# EAGLE design RasPi-BplusHAT (EAGLE 7.3.0)
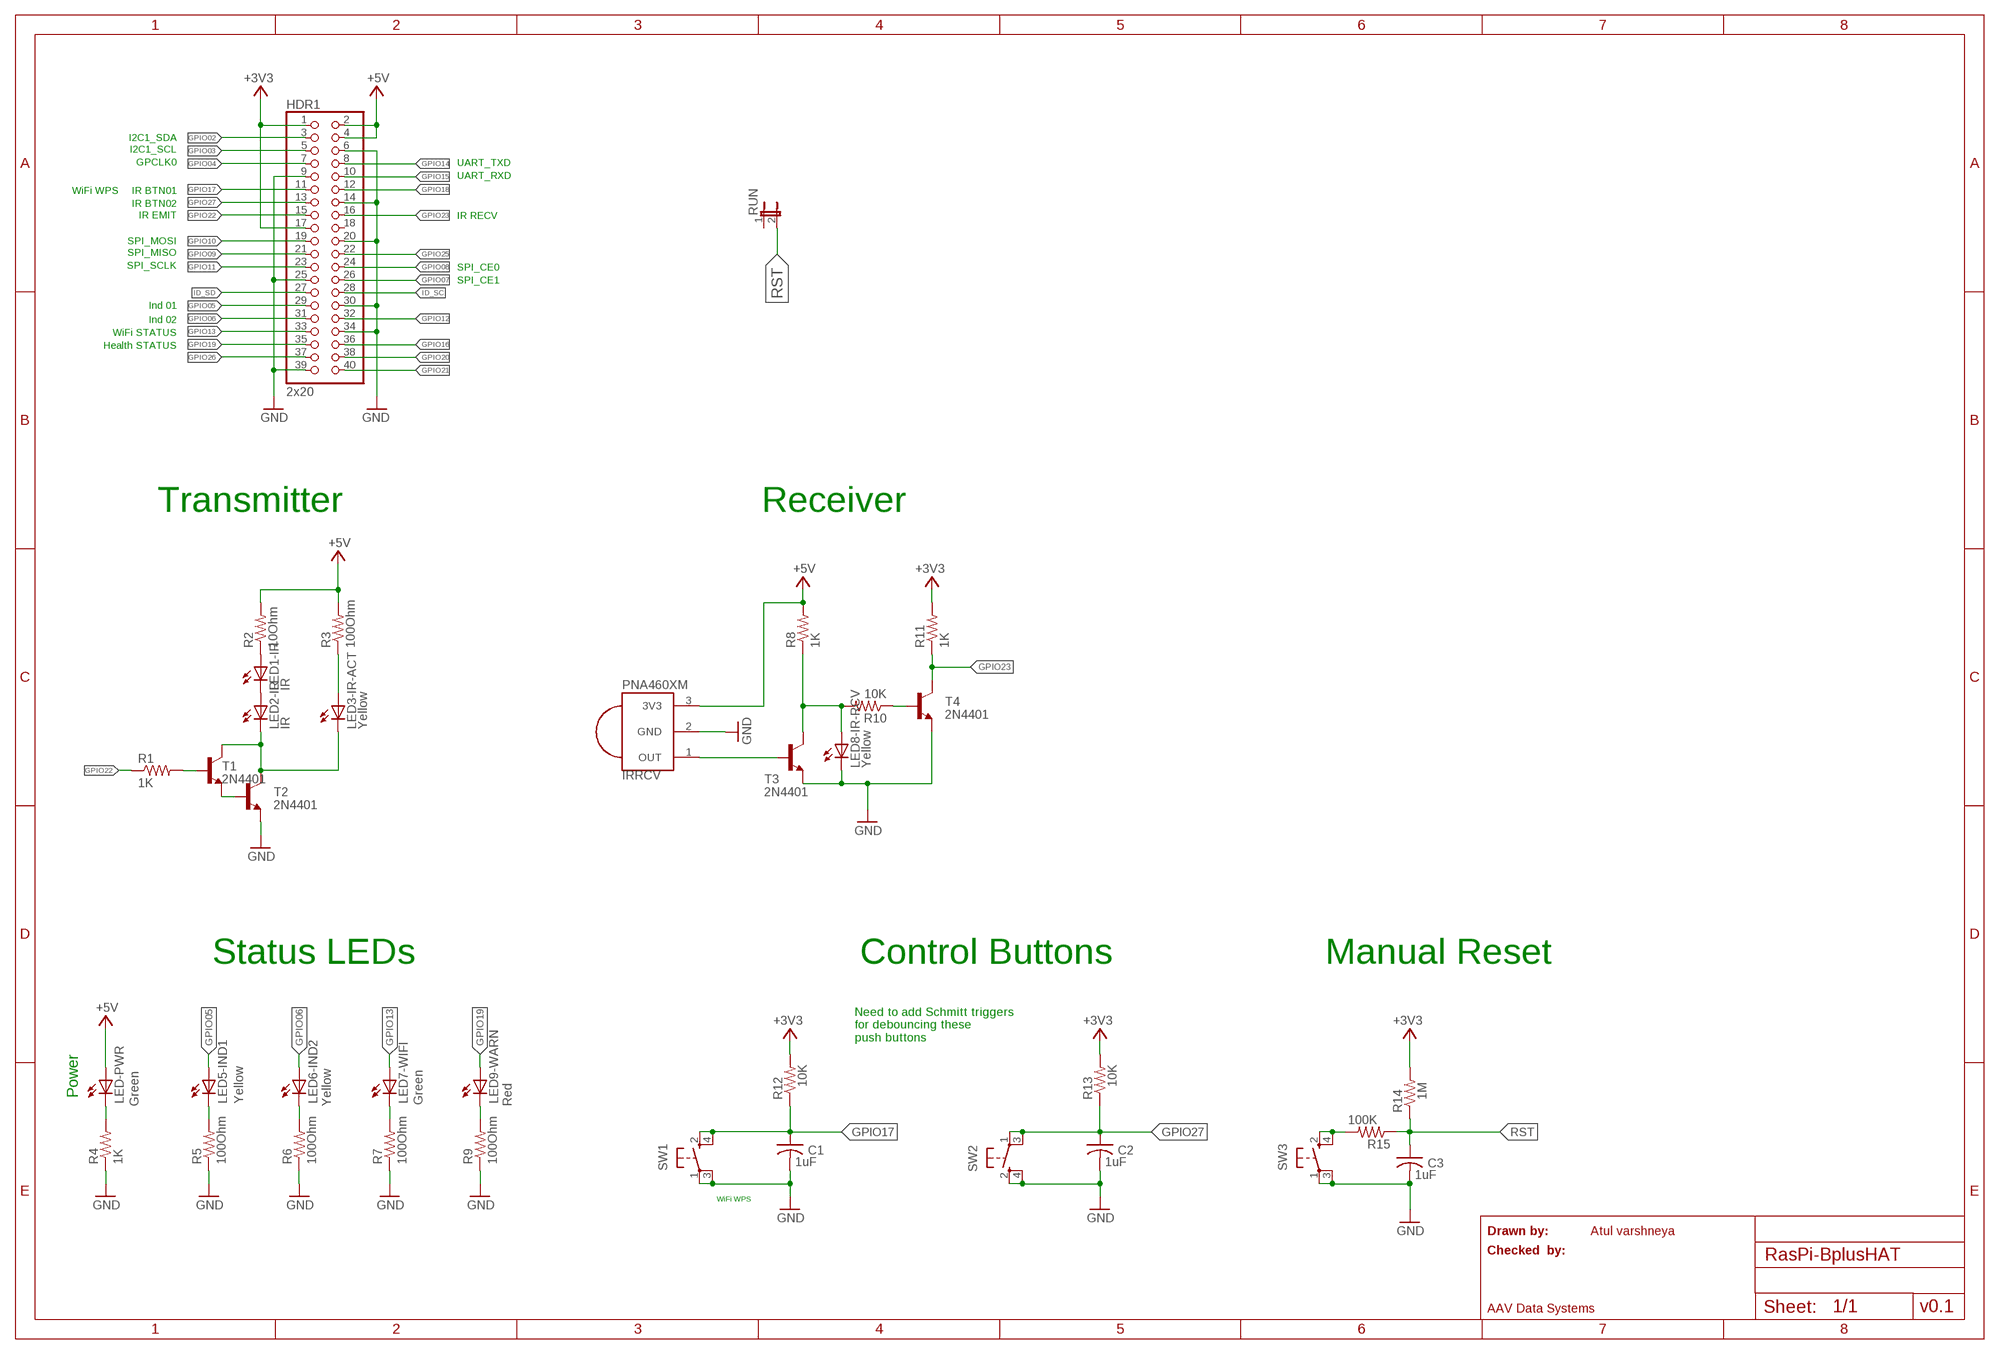
[diagram p0: schematic, sheet 1]

## Parts
C1  1uF  C-USC0805  [C0805]
C2  1uF  C-USC0805  [C0805]
C3  1uF  C-USC0805  [C0805]
HDR1  2x20  PINHD-2X20  [2X20]
IRRCV  PNA460XM  [PNA460XM]
LED1-IR  IR  LEDMICRO-SIDELED  [MICRO-SIDELED]
LED2-IR  IR  LEDMICRO-SIDELED  [MICRO-SIDELED]
LED3-IR-ACT  Yellow  LEDCHIPLED_0805  [CHIPLED_0805]
LED5-IND1  Yellow  LEDCHIPLED_0805  [CHIPLED_0805]
LED6-IND2  Yellow  LEDCHIPLED_0805  [CHIPLED_0805]
LED7-WIFI  Green  LEDCHIPLED_0805  [CHIPLED_0805]
LED8-IR-RCV  Yellow  LEDCHIPLED_0805  [CHIPLED_0805]
LED9-WARN  Red  LEDCHIPLED_0805  [CHIPLED_0805]
LED-PWR  Green  LEDCHIPLED_0805  [CHIPLED_0805]
R1  1K  R-US_R0805  [R0805]
R2  10Ohm  R-US_R0805  [R0805]
R3  100Ohm  R-US_R0805  [R0805]
R4  1K  R-US_R0805  [R0805]
R5  100Ohm  R-US_R0805  [R0805]
R6  100Ohm  R-US_R0805  [R0805]
R7  100Ohm  R-US_R0805  [R0805]
R8  1K  R-US_R0805  [R0805]
R9  100Ohm  R-US_R0805  [R0805]
R10  10K  R-US_R0805  [R0805]
R11  1K  R-US_R0805  [R0805]
R12  10K  R-US_R0805  [R0805]
R13  10K  R-US_R0805  [R0805]
R14  1M  R-US_R0805  [R0805]
R15  100K  R-US_R0805  [R0805]
RUN  JP1E  [JP1]
SW1  SPST_TACT-KMR2  [KMR2]
SW2  SPST_TACT-KMR2  [KMR2]
SW3  SPST_TACT-KMR2  [KMR2]
T1  2N4401  MMBT4401LT1-NPN-SOT23-BEC  [SOT23-BEC]
T2  2N4401  MMBT4401LT1-NPN-SOT23-BEC  [SOT23-BEC]
T3  2N4401  MMBT4401LT1-NPN-SOT23-BEC  [SOT23-BEC]
T4  2N4401  MMBT4401LT1-NPN-SOT23-BEC  [SOT23-BEC]

## Nets
+3V3: HDR1.1 HDR1.17 R11.2 R12.2 R13.2 R14.2
+5V: HDR1.2 HDR1.4 IRRCV.3(3V3) LED-PWR.A R2.2 R3.2 R8.2
GND: C1.2 C2.2 C3.2 HDR1.6 HDR1.9 HDR1.14 HDR1.20 HDR1.25 HDR1.30 HDR1.34 HDR1.39 IRRCV.2(GND) LED8-IR-RCV.C R4.1 R5.1 R6.1 R7.1 R9.1 SW1.1(P) SW1.3(P1) SW2.2(S) SW2.4(S1) SW3.1(P) SW3.3(P1) T2.E T3.E T4.E
GPIO02: HDR1.3
GPIO03: HDR1.5
GPIO04: HDR1.7
GPIO05: HDR1.29 LED5-IND1.A
GPIO06: HDR1.31 LED6-IND2.A
GPIO07: HDR1.26
GPIO08: HDR1.24
GPIO09: HDR1.21
GPIO10: HDR1.19
GPIO11: HDR1.23
GPIO12: HDR1.32
GPIO13: HDR1.33 LED7-WIFI.A
GPIO14: HDR1.8
GPIO15: HDR1.10
GPIO16: HDR1.36
GPIO17: C1.1 HDR1.11 R12.1 SW1.2(S) SW1.4(S1)
GPIO18: HDR1.12
GPIO19: HDR1.35 LED9-WARN.A
GPIO20: HDR1.38
GPIO21: HDR1.40
GPIO22: HDR1.15 R1.1
GPIO23: HDR1.16 R11.1 T4.C
GPIO25: HDR1.22
GPIO26: HDR1.37
GPIO27: C2.1 HDR1.13 R13.1 SW2.1(P) SW2.3(P1)
ID_SC: HDR1.28
ID_SD: HDR1.27
N$1: R15.2 SW3.2(S) SW3.4(S1)
N$2: LED1-IR.A R2.1
N$3: LED1-IR.C LED2-IR.A
N$4: LED2-IR.C LED3-IR-ACT.C T1.C T2.C
N$5: R1.2 T1.B
N$6: LED3-IR-ACT.A R3.1
N$7: LED5-IND1.C R5.2
N$8: IRRCV.1(OUT) T3.B
N$10: LED8-IR-RCV.A R8.1 R10.2 T3.C
N$11: T1.E T2.B
N$14: LED7-WIFI.C R7.2
N$16: LED9-WARN.C R9.2
N$17: LED6-IND2.C R6.2
N$21: LED-PWR.C R4.2
N$23: R10.1 T4.B
RST: C3.1 R14.1 R15.1 RUN.2
Unconnected: HDR1.18 RUN.1

## Notes on the sheet
- I2C1_SDA
- I2C1_SCL
- GPCLK0
- UART_TXD
- UART_RXD
- WiFi WPS | IR BTN01
- IR BTN02
- IR EMIT
- IR RECV
- SPI_MOSI
- SPI_MISO
- SPI_SCLK
- SPI_CE0
- SPI_CE1
- Ind 01
- Ind 02
- WiFi STATUS
- Health STATUS
- Receiver
- Transmitter
- Status LEDs | Control Buttons | Manual Reset
- Need to add Schmitt triggers 
  for debouncing these 
  push buttons
- Power
- WiFi WPS
- Drawn by: | Atul varshneya
- Checked  by:
- AAV Data Systems | v0.1

## Library data of the parts
C1-C3 = adafruit:C-US: CAPACITOR, American symbol; MPN: MC0805B104K160CT; OC_NEWARK: 06R3738
HDR1 = adafruit:PINHD-2X20: PIN HEADER; OC_NEWARK: unknown
IRRCV = adafruit:PNA460XM: IR 38KHz receiver PNA4602 and related receivers http://www.ladyada.net/library/pcb/eaglelibrary.html; MPN: TSOP38238; OC_NEWARK: 02P9885
LED1-IR LED2-IR = led:LED: LED OSRAM: - CHIPLED LG R971, LG N971, LY N971, LG Q971, LY Q971, LO R971, LY R971 LH N974, LH R974 LS Q976, LO Q976, LY Q976 LO Q996 - Hyper CHIPLED LW Q18S LB Q993, LB Q99A, LB R99A - SideLED LS A670, LO A670, LY A670, LG A670, LP A670 LB A673, LV A673, LT A673, LW A673 LH A674 LY A675 LS A676, LA A676, LO A676, LY A676, LW A676 LS A679, LY A679, LG A679 - Hyper Micro SIDELED® LS Y876, LA Y876, LO Y876, LY Y876 LT Y87S - SmartLED LW L88C, LW L88S LB L89C, LB L89S, LG L890 LS L89K, LO L89K, LY L89K LS L896, LA L896, LO L896, LY L896 - TOPLED LS T670, LO T670, LY T670, LG T670, LP T670 LSG T670, LSP T670, LSY T670, LOP T670, LYG T670 LG T671, LOG T671, LSG T671 LB T673, LV T673, LT T673, LW T673 LH T674 LS T676, LA T676, LO T676, LY T676, LB T676, LH T676, LSB T676, LW T676 LB T67C, LV T67C, LT T67C, LS T67K, LO T67K, LY T67K, LW E67C LS E67B, LA E67B, LO E67B, LY E67B, LB E67C, LV E67C, LT E67C LW T67C LS T679, LY T679, LG T679 LS T770, LO T770, LY T770, LG T770, LP T770 LB T773, LV T773, LT T773, LW T773 LH T774 LS E675, LA E675, LY E675, LS T675 LS T776, LA T776, LO T776, LY T776, LB T776 LHGB T686 LT T68C, LB T68C - Hyper Mini TOPLED® LB M676 - Mini TOPLED Santana® LG M470 LS M47K, LO M47K, LY M47K Source: http://www.osram.convergy.de LUXEON: - LUMILED® LXK2-PW12-R00, LXK2-PW12-S00, LXK2-PW14-U00, LXK2-PW14-V00 LXK2-PM12-R00, LXK2-PM12-S00, LXK2-PM14-U00 LXK2-PE12-Q00, LXK2-PE12-R00, LXK2-PE12-S00, LXK2-PE14-T00, LXK2-PE14-U00 LXK2-PB12-K00, LXK2-PB12-L00, LXK2-PB12-M00, LXK2-PB14-N00, LXK2-PB14-P00, LXK2-PB14-Q00 LXK2-PR12-L00, LXK2-PR12-M00, LXK2-PR14-Q00, LXK2-PR14-R00 LXK2-PD12-Q00, LXK2-PD12-R00, LXK2-PD12-S00 LXK2-PH12-R00, LXK2-PH12-S00 LXK2-PL12-P00, LXK2-PL12-Q00, LXK2-PL12-R00 Source: www.luxeon.com KINGBRIGHT: KA-3528ASYC Source: www.kingbright.com; MPN: VSMB2943SLX01; OC_NEWARK: 62W1340
LED3-IR-ACT LED5-IND1 LED6-IND2 LED8-IR-RCV = led:LED: LED OSRAM: - CHIPLED LG R971, LG N971, LY N971, LG Q971, LY Q971, LO R971, LY R971 LH N974, LH R974 LS Q976, LO Q976, LY Q976 LO Q996 - Hyper CHIPLED LW Q18S LB Q993, LB Q99A, LB R99A - SideLED LS A670, LO A670, LY A670, LG A670, LP A670 LB A673, LV A673, LT A673, LW A673 LH A674 LY A675 LS A676, LA A676, LO A676, LY A676, LW A676 LS A679, LY A679, LG A679 - Hyper Micro SIDELED® LS Y876, LA Y876, LO Y876, LY Y876 LT Y87S - SmartLED LW L88C, LW L88S LB L89C, LB L89S, LG L890 LS L89K, LO L89K, LY L89K LS L896, LA L896, LO L896, LY L896 - TOPLED LS T670, LO T670, LY T670, LG T670, LP T670 LSG T670, LSP T670, LSY T670, LOP T670, LYG T670 LG T671, LOG T671, LSG T671 LB T673, LV T673, LT T673, LW T673 LH T674 LS T676, LA T676, LO T676, LY T676, LB T676, LH T676, LSB T676, LW T676 LB T67C, LV T67C, LT T67C, LS T67K, LO T67K, LY T67K, LW E67C LS E67B, LA E67B, LO E67B, LY E67B, LB E67C, LV E67C, LT E67C LW T67C LS T679, LY T679, LG T679 LS T770, LO T770, LY T770, LG T770, LP T770 LB T773, LV T773, LT T773, LW T773 LH T774 LS E675, LA E675, LY E675, LS T675 LS T776, LA T776, LO T776, LY T776, LB T776 LHGB T686 LT T68C, LB T68C - Hyper Mini TOPLED® LB M676 - Mini TOPLED Santana® LG M470 LS M47K, LO M47K, LY M47K Source: http://www.osram.convergy.de LUXEON: - LUMILED® LXK2-PW12-R00, LXK2-PW12-S00, LXK2-PW14-U00, LXK2-PW14-V00 LXK2-PM12-R00, LXK2-PM12-S00, LXK2-PM14-U00 LXK2-PE12-Q00, LXK2-PE12-R00, LXK2-PE12-S00, LXK2-PE14-T00, LXK2-PE14-U00 LXK2-PB12-K00, LXK2-PB12-L00, LXK2-PB12-M00, LXK2-PB14-N00, LXK2-PB14-P00, LXK2-PB14-Q00 LXK2-PR12-L00, LXK2-PR12-M00, LXK2-PR14-Q00, LXK2-PR14-R00 LXK2-PD12-Q00, LXK2-PD12-R00, LXK2-PD12-S00 LXK2-PH12-R00, LXK2-PH12-S00 LXK2-PL12-P00, LXK2-PL12-Q00, LXK2-PL12-R00 Source: www.luxeon.com KINGBRIGHT: KA-3528ASYC Source: www.kingbright.com; MPN: 150080YS75000; OC_NEWARK: 95W3804
LED7-WIFI LED-PWR = led:LED: LED OSRAM: - CHIPLED LG R971, LG N971, LY N971, LG Q971, LY Q971, LO R971, LY R971 LH N974, LH R974 LS Q976, LO Q976, LY Q976 LO Q996 - Hyper CHIPLED LW Q18S LB Q993, LB Q99A, LB R99A - SideLED LS A670, LO A670, LY A670, LG A670, LP A670 LB A673, LV A673, LT A673, LW A673 LH A674 LY A675 LS A676, LA A676, LO A676, LY A676, LW A676 LS A679, LY A679, LG A679 - Hyper Micro SIDELED® LS Y876, LA Y876, LO Y876, LY Y876 LT Y87S - SmartLED LW L88C, LW L88S LB L89C, LB L89S, LG L890 LS L89K, LO L89K, LY L89K LS L896, LA L896, LO L896, LY L896 - TOPLED LS T670, LO T670, LY T670, LG T670, LP T670 LSG T670, LSP T670, LSY T670, LOP T670, LYG T670 LG T671, LOG T671, LSG T671 LB T673, LV T673, LT T673, LW T673 LH T674 LS T676, LA T676, LO T676, LY T676, LB T676, LH T676, LSB T676, LW T676 LB T67C, LV T67C, LT T67C, LS T67K, LO T67K, LY T67K, LW E67C LS E67B, LA E67B, LO E67B, LY E67B, LB E67C, LV E67C, LT E67C LW T67C LS T679, LY T679, LG T679 LS T770, LO T770, LY T770, LG T770, LP T770 LB T773, LV T773, LT T773, LW T773 LH T774 LS E675, LA E675, LY E675, LS T675 LS T776, LA T776, LO T776, LY T776, LB T776 LHGB T686 LT T68C, LB T68C - Hyper Mini TOPLED® LB M676 - Mini TOPLED Santana® LG M470 LS M47K, LO M47K, LY M47K Source: http://www.osram.convergy.de LUXEON: - LUMILED® LXK2-PW12-R00, LXK2-PW12-S00, LXK2-PW14-U00, LXK2-PW14-V00 LXK2-PM12-R00, LXK2-PM12-S00, LXK2-PM14-U00 LXK2-PE12-Q00, LXK2-PE12-R00, LXK2-PE12-S00, LXK2-PE14-T00, LXK2-PE14-U00 LXK2-PB12-K00, LXK2-PB12-L00, LXK2-PB12-M00, LXK2-PB14-N00, LXK2-PB14-P00, LXK2-PB14-Q00 LXK2-PR12-L00, LXK2-PR12-M00, LXK2-PR14-Q00, LXK2-PR14-R00 LXK2-PD12-Q00, LXK2-PD12-R00, LXK2-PD12-S00 LXK2-PH12-R00, LXK2-PH12-S00 LXK2-PL12-P00, LXK2-PL12-Q00, LXK2-PL12-R00 Source: www.luxeon.com KINGBRIGHT: KA-3528ASYC Source: www.kingbright.com; MPN: 150080GS75000; OC_NEWARK: 95W3800
LED9-WARN = led:LED: LED OSRAM: - CHIPLED LG R971, LG N971, LY N971, LG Q971, LY Q971, LO R971, LY R971 LH N974, LH R974 LS Q976, LO Q976, LY Q976 LO Q996 - Hyper CHIPLED LW Q18S LB Q993, LB Q99A, LB R99A - SideLED LS A670, LO A670, LY A670, LG A670, LP A670 LB A673, LV A673, LT A673, LW A673 LH A674 LY A675 LS A676, LA A676, LO A676, LY A676, LW A676 LS A679, LY A679, LG A679 - Hyper Micro SIDELED® LS Y876, LA Y876, LO Y876, LY Y876 LT Y87S - SmartLED LW L88C, LW L88S LB L89C, LB L89S, LG L890 LS L89K, LO L89K, LY L89K LS L896, LA L896, LO L896, LY L896 - TOPLED LS T670, LO T670, LY T670, LG T670, LP T670 LSG T670, LSP T670, LSY T670, LOP T670, LYG T670 LG T671, LOG T671, LSG T671 LB T673, LV T673, LT T673, LW T673 LH T674 LS T676, LA T676, LO T676, LY T676, LB T676, LH T676, LSB T676, LW T676 LB T67C, LV T67C, LT T67C, LS T67K, LO T67K, LY T67K, LW E67C LS E67B, LA E67B, LO E67B, LY E67B, LB E67C, LV E67C, LT E67C LW T67C LS T679, LY T679, LG T679 LS T770, LO T770, LY T770, LG T770, LP T770 LB T773, LV T773, LT T773, LW T773 LH T774 LS E675, LA E675, LY E675, LS T675 LS T776, LA T776, LO T776, LY T776, LB T776 LHGB T686 LT T68C, LB T68C - Hyper Mini TOPLED® LB M676 - Mini TOPLED Santana® LG M470 LS M47K, LO M47K, LY M47K Source: http://www.osram.convergy.de LUXEON: - LUMILED® LXK2-PW12-R00, LXK2-PW12-S00, LXK2-PW14-U00, LXK2-PW14-V00 LXK2-PM12-R00, LXK2-PM12-S00, LXK2-PM14-U00 LXK2-PE12-Q00, LXK2-PE12-R00, LXK2-PE12-S00, LXK2-PE14-T00, LXK2-PE14-U00 LXK2-PB12-K00, LXK2-PB12-L00, LXK2-PB12-M00, LXK2-PB14-N00, LXK2-PB14-P00, LXK2-PB14-Q00 LXK2-PR12-L00, LXK2-PR12-M00, LXK2-PR14-Q00, LXK2-PR14-R00 LXK2-PD12-Q00, LXK2-PD12-R00, LXK2-PD12-S00 LXK2-PH12-R00, LXK2-PH12-S00 LXK2-PL12-P00, LXK2-PL12-Q00, LXK2-PL12-R00 Source: www.luxeon.com KINGBRIGHT: KA-3528ASYC Source: www.kingbright.com; MPN: 150080RS75000; OC_NEWARK: 95W3801
R1 R4 R8 R11 = adafruit:R-US_: RESISTOR, American symbol; MF: VISHAY/DALE; MPN: CRCW08051K00FKEA; OC_NEWARK: 52K9723
R2 = adafruit:R-US_: RESISTOR, American symbol; MF: VISHAY/DALE; MPN: CRCW080510R0FKEA; OC_NEWARK: 52K9804
R3 R5-R7 R9 = adafruit:R-US_: RESISTOR, American symbol; MF: VISHAY/DALE; MPN: CRCW0805100RFKEA; OC_NEWARK: 52K9809
R10 R12-R15 = adafruit:R-US_: RESISTOR, American symbol; MF: VISHAY/DALE; MPN: CRCW080510K0FKEA; OC_NEWARK: 52K9795
RUN = jumper:JP1E: JUMPER; MPN: 2211S-02G; OC_NEWARK: 08N6744
SW1-SW3 = adafruit:SPST_TACT: SMT 6mm switch, EVQQ2 series http://www.ladyada.net/library/eagle; OC_NEWARK: unknown
T1 T2 = transistor-neu-to92:*-NPN-: NPN Transistror BF959 corrected 2008.03.06; MPN: MMBT4401-TP; OC_NEWARK: 51T4931
T3 T4 = transistor:*-NPN-: NPN Transistror BF959 corrected 2008.03.06; MPN: MMBT4401-TP; OC_NEWARK: 51T4931

## Board
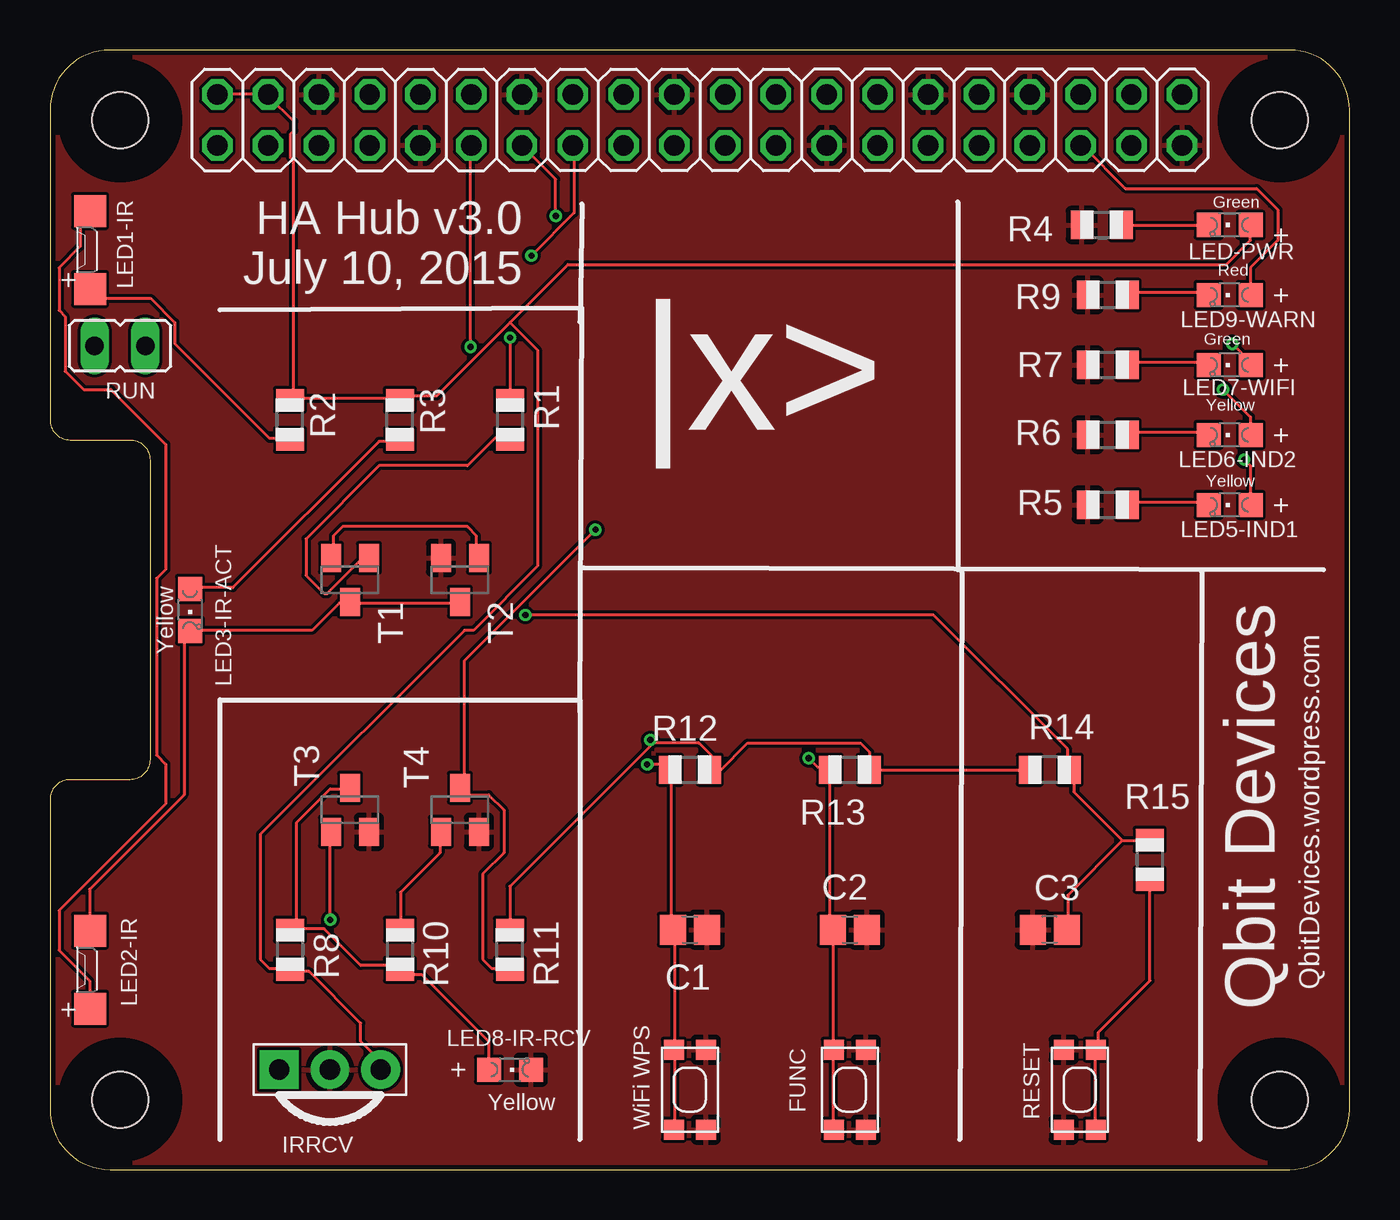
[diagram p1: board, top side]
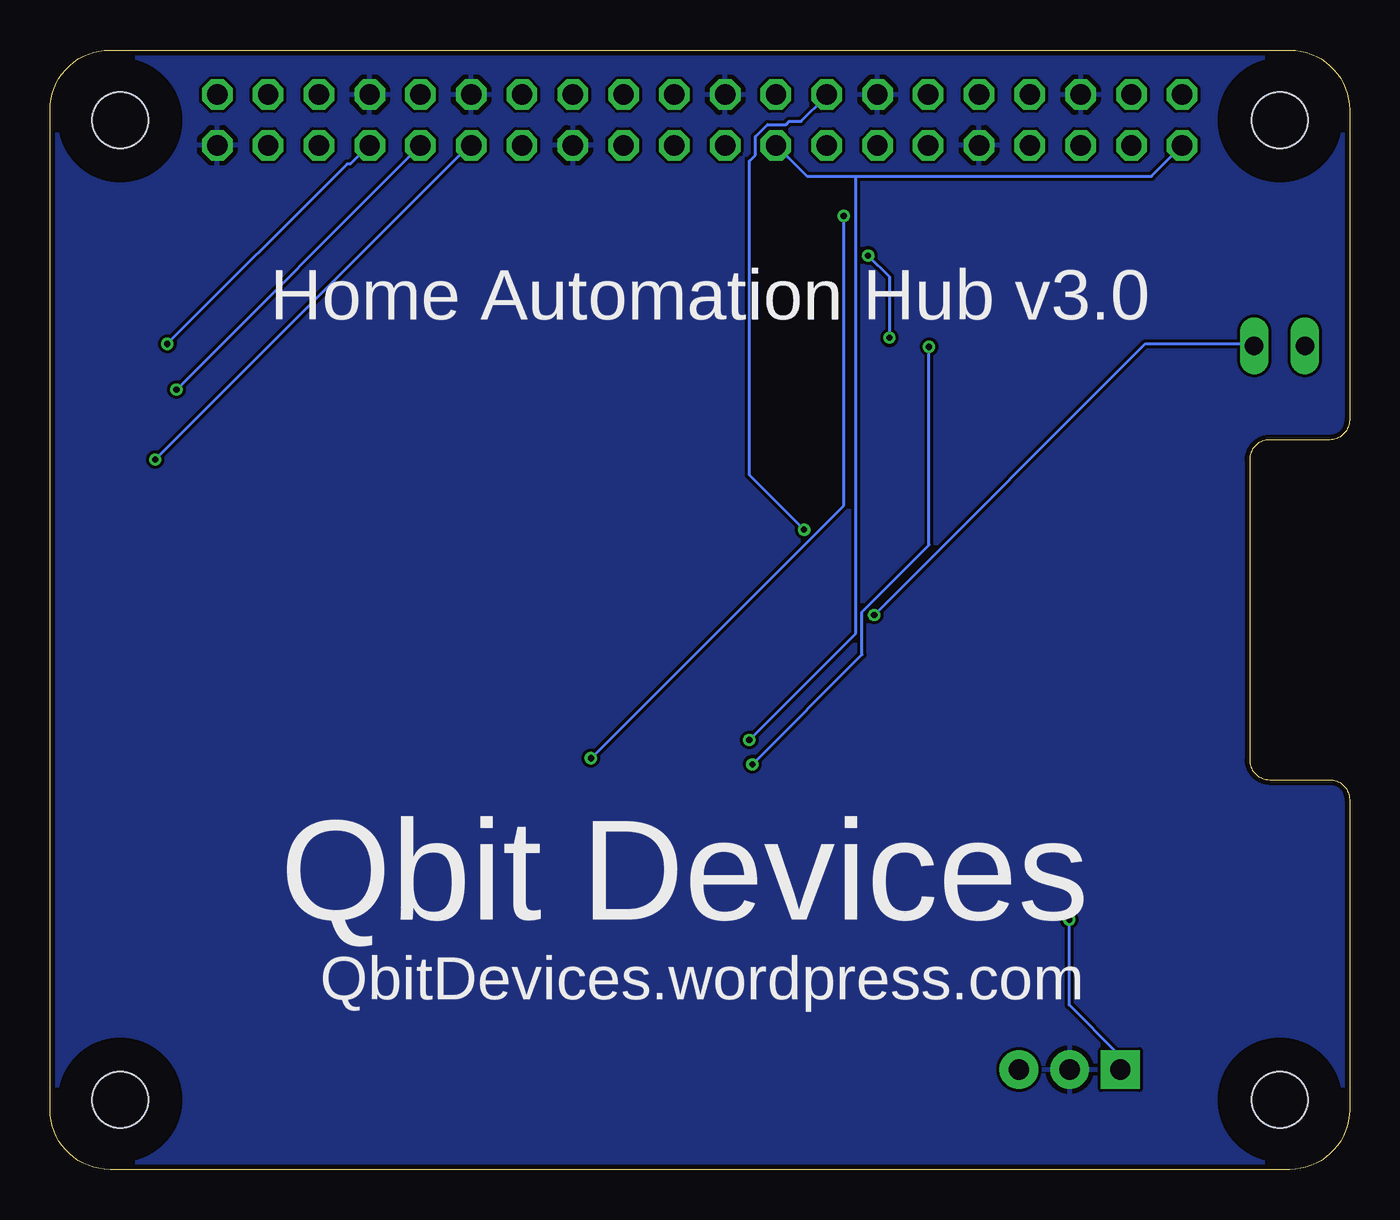
[diagram p2: board, bottom side, seen from below]

Size 65 x 56 mm. Coordinates in mm from the lower left corner, seen from the top.
Outline: 0,3 arc90 3,0 62,0 arc90 65,3 65,53 arc90 62,56 3,56 arc90 0,53 0,37.5 arc90 1,36.5 4,36.5 arc-90 5,35.5 5,20.5 arc-90 4,19.5 1,19.5 arc90 0,18.5 0,3
Copper layers (1*16): Top 0.035mm / dielectric 1.5mm / Bottom 0.035mm
Design rules "ITEADstudio_DRC": minimum track width 6mil, minimum drill 12mil, track to track 6mil, track to pad 6mil, pad to pad 6mil, via to via 6mil, smd to smd 0mil, copper to edge 10mil, drill to drill 10mil, minimum pad ring 10mil, minimum via ring 6mil, stop-mask expansion 2mil, vias tented up to drill 100mil, thermal gap 10mil
Holes 2.8 mm at 3.5,3.5 3.5,52.5 61.5,52.5 61.5,3.5
tRestrict: area 1.9,51 to 5,54; area 60,51 to 63,54; area 60,1.9 to 63,5; area 1.9,1.9 to 5,5
bRestrict: area 1.9,1.9 to 5,5; area 1.9,51 to 5,54; area 60,1.9 to 63,5; area 60,51 to 63,54

### Footprints (pad centres in the part's own frame; a part is rotated, then mirrored left to right if it is on the bottom)
C0805 = smd 1.3 x 1.5: 1 -0.85,0; 2 0.85,0
2X20 = drill 1.016 octagon: 1 -24.13,-1.27; 2 -24.13,1.27; 3 -21.59,-1.27; 4 -21.59,1.27; 5 -19.05,-1.27; 6 -19.05,1.27; 7 -16.51,-1.27; 8 -16.51,1.27; 9 -13.97,-1.27; 10 -13.97,1.27; 11 -11.43,-1.27; 12 -11.43,1.27; 13 -8.89,-1.27; 14 -8.89,1.27; 15 -6.35,-1.27; 16 -6.35,1.27; 17 -3.81,-1.27; 18 -3.81,1.27; 19 -1.27,-1.27; 20 -1.27,1.27; 21 1.27,-1.27; 22 1.27,1.27; 23 3.81,-1.27; 24 3.81,1.27; 25 6.35,-1.27; 26 6.35,1.27; 27 8.89,-1.27; 28 8.89,1.27; 29 11.43,-1.27; 30 11.43,1.27; 31 13.97,-1.27; 32 13.97,1.27; 33 16.51,-1.27; 34 16.51,1.27; 35 19.05,-1.27; 36 19.05,1.27; 37 21.59,-1.27; 38 21.59,1.27; 39 24.13,-1.27; 40 24.13,1.27
PNA460XM = drill 1.016 pad 1.93 square: 1 -2.54,0 | drill 1.016 pad 1.93: 2 0,0; 3 2.54,0
MICRO-SIDELED = smd 1.6 x 1.6: A 0,1.95; C 0,-1.95
CHIPLED_0805 = smd 1.2 x 1.2: A 0,-1.05; C 0,1.05
R0805 = smd 1.1 x 1.4: 1 -1,0; 2 1,0
JP1 = drill 0.914 long: 1 0,-1.27; 2 0,1.27
KMR2 = smd 1 x 1: 1 2,0.8; 2 2,-0.8; 3 -2,0.8; 4 -2,-0.8
SOT23-BEC = smd 1 x 1.4: B -0.95,-1.1; C 0,1.1; E 0.95,-1.1

### Placement (x,y rotation side)
C1  32,12 0 top
C2  40,12 0 top
C3  50,12 180 top
HDR1  32.5,52.5 0 top
IRRCV  14,5 0 top
LED1-IR  2,46 180 top
LED2-IR  2,10 180 top
LED3-IR-ACT  7,28 180 top
LED5-IND1  59,33.25 90 top
LED6-IND2  59,36.75 90 top
LED7-WIFI  59,40.25 90 top
LED8-IR-RCV  23,5 270 top
LED9-WARN  59,43.75 90 top
LED-PWR  59,47.25 90 top
R1  23,37.5 270 top
R2  12,37.5 90 top
R3  17.5,37.5 90 top
R4  52.6,47.25 0 top
R5  52.9,33.25 0 top
R6  52.9,36.75 0 top
R7  52.9,40.25 0 top
R8  12,11 270 top
R9  52.9,43.75 0 top
R10  17.5,11 270 top
R11  23,11 90 top
R12  32,20 0 top
R13  40,20 0 top
R14  50,20 180 top
R15  55,15.5 270 top
RUN  3.5,41.2 270 top
SW1  32,4 270 top
SW2  40,4 90 top
SW3  51.5,4 90 top
T1  15,29.5 180 top
T2  20.5,29.5 180 top
T3  15,18 0 top
T4  20.5,18 0 top

### Tracks (layer width: path | path; a pad name or v marks a point on that pad's centre or on a via)
+3V3  (via drill 0.3)
  Top 0.152: R14.2 48.92,19.96 41.15,19.96 R13.2 41,20.12 41,20.88 40.54,21.34 34.9,21.34 33.53,19.96 33.07,19.96 R12.2 33.07,20.12 33.07,20.73 32.46,21.34 30.18,21.34 | 30.18,21.34 23.01,14.17 23.01,12.04 R11.2 | 30.18,21.34 v30.02,21.49
  Bottom 0.152: 24.69,49.68 27.13,49.68 28.65,51.21 HDR1.17 | 24.69,49.68 9.91,49.68 8.38,51.21 HDR1.1 | 24.69,49.68 24.69,26.82 v30.02,21.49
+5V
  Top 0.152: IRRCV.3 16.46,5.03 16.46,5.49 15.54,6.4 15.54,7.32 12.95,9.91 12.04,9.91 R8.2 11.89,10.06 10.97,10.06 10.52,10.52 10.52,16.76 20.73,26.98 21.18,26.98 24.38,30.18 24.38,41 23.01,42.37 | HDR1.2 8.38,53.8 10.82,53.8 HDR1.4 10.97,53.65 12.19,52.43 12.19,51.97 12.04,51.82 12.04,50.6 12.19,50.44 12.19,38.56 | 23.01,42.37 19.36,38.71 17.68,38.71 17.53,38.56 R3.2 17.37,38.56 12.19,38.56 | 23.01,42.37 25.91,45.26 58.83,45.26 60.05,46.48 LED-PWR.A | 12.19,38.56 12.04,38.56 R2.2 12.19,38.56
GND
  pour Bottom: 0,3 arc90 3,0 62,0 arc90 65,3 65,53 arc90 62,56 3,56 arc90 0,53 0,37.5 arc90 1,36.5 4,36.5 arc-90 5,35.5 5,20.5 arc-90 4,19.5 1,19.5 arc90 0,18.5
  pour Top: 0,3 arc90 3,0 62,0 arc90 65,3 65,53 arc90 62,56 3,56 arc90 0,53 0,37.5 arc90 1,36.5 4,36.5 arc-90 5,35.5 5,20.5 arc-90 4,19.5 1,19.5 arc90 0,18.5
GPIO05  (via drill 0.3)
  Top 0.152: v59.74,35.51 60.05,35.2 60.05,33.38 LED5-IND1.A
  Bottom 0.152: v59.74,35.51 44.04,51.21 HDR1.29
GPIO06  (via drill 0.3)
  Top 0.152: v58.67,39.01 60.05,37.64 60.05,36.88 LED6-IND2.A
  Bottom 0.152: v58.67,39.01 46.48,51.21 HDR1.31
GPIO13  (via drill 0.3)
  Top 0.152: v59.13,41.3 60.05,40.39 LED7-WIFI.A
  Bottom 0.152: v59.13,41.3 50.14,50.29 49.99,50.29 49.07,51.21 HDR1.33
GPIO17  (via drill 0.3)
  Top 0.152: SW1.2 31.24,2.13 31.24,5.94 SW1.4 31.24,6.1 31.24,11.89 C1.1 31.09,12.04 31.09,19.96 R12.1 30.94,20.12 30.79,20.27 v29.87,20.27 | v21.03,41.15 21.03,51.21 HDR1.11
  Bottom 0.152: v21.03,41.15 21.03,31.24 24.38,27.89 24.38,25.76 v29.87,20.27
GPIO19
  Top 0.152: LED9-WARN.A 60.05,43.89 60.05,45.11 61.42,46.48 61.42,48.01 60.35,49.07 53.8,49.07 51.66,51.21 HDR1.35
GPIO22  (via drill 0.3)
  Top 0.152: v23.01,41.6 23.01,38.56 R1.1 | v24.08,45.72 26.21,47.85 26.21,51.21 HDR1.15
  Bottom 0.152: v23.01,41.6 23.01,44.65 v24.08,45.72
GPIO23  (via drill 0.3)
  Top 0.152: R11.1 22.86,10.06 22.1,10.06 21.64,10.52 21.64,14.78 22.71,15.85 22.71,17.98 21.95,18.75 20.88,18.75 20.57,19.05 T4.C 20.57,19.2 20.73,19.36 20.73,25.45 v27.28,32
  Bottom 0.152: v27.28,32 30.02,34.75 30.02,50.44 29.72,50.75 29.72,51.66 29.11,52.27 28.19,52.27 28.04,52.43 27.43,52.43 26.21,53.65 HDR1.16
GPIO27  (via drill 0.3)
  Top 0.152: SW2.3 39.17,2.13 39.17,5.94 SW2.1 39.17,6.1 39.17,11.89 C2.1 39.01,12.04 39.01,19.96 R13.1 38.86,20.12 38.41,20.12 v37.95,20.57 | v25.3,47.7 25.3,49.53 23.62,51.21 HDR1.13
  Bottom 0.152: v25.3,47.7 25.3,33.22 v37.95,20.57
N$1
  Top 0.152: SW3.4 52.27,2.13 52.27,5.94 SW3.2 52.43,6.1 52.43,6.86 55.02,9.45 55.02,14.48 R15.2
N$2
  Top 0.152: R2.1 11.89,36.58 10.97,36.58 6.25,41.3 6.25,42.37 5.03,43.59 2.59,43.59 2.13,44.04 LED1-IR.A
N$3
  Top 0.152: LED2-IR.A 1.98,8.08 1.98,9.45 0.46,10.97 0.46,12.95 5.79,18.29 5.79,20.27 5.33,20.73 5.33,29.57 5.79,30.02 5.79,36.27 3.05,39.01 1.68,39.01 0.76,39.93 0.76,42.67 0.46,42.98 0.46,45.11 1.52,46.18 1.52,47.4 1.98,47.85 LED1-IR.C
N$4
  Top 0.152: T2.C 20.42,28.35 15.09,28.35 T1.C 14.94,28.35 14.48,28.35 13.11,26.98 7.01,26.98 LED3-IR-ACT.C 6.86,26.82 6.71,26.67 6.71,18.75 1.98,14.02 1.98,12.04 LED2-IR.C
N$5
  Top 0.152: T1.B 15.85,30.48 15.54,30.48 13.87,28.8 13.72,28.8 12.8,29.72 12.8,31.55 16.46,35.2 20.88,35.2 22.25,36.58 22.86,36.58 R1.2
N$6
  Top 0.152: LED3-IR-ACT.A 7.01,29.11 9.14,29.11 16.46,36.42 17.37,36.42 R3.1
N$7
  Top 0.152: LED5-IND1.C 57.91,33.38 53.95,33.38 R5.2
N$8  (via drill 0.3)
  Top 0.152: v14.02,12.5 14.02,16.76 T3.B
  Bottom 0.152: v14.02,12.5 14.02,8.23 11.58,5.79 11.58,5.03 IRRCV.1
N$10
  Top 0.152: LED8-IR-RCV.A 21.95,5.03 21.95,6.4 18.59,9.75 17.68,9.75 17.53,9.91 R10.2 17.37,10.06 17.22,10.21 15.54,10.21 13.72,12.04 12.34,12.04 | 12.34,12.04 12.04,12.04 R8.1 12.34,12.04 | 12.34,12.04 12.34,17.37 14.02,19.05 14.94,19.05 T3.C
N$11
  Top 0.152: T1.E 14.17,30.63 14.17,31.7 14.63,32.16 20.88,32.16 21.34,31.7 21.34,30.63 T2.B
N$14
  Top 0.152: LED7-WIFI.C 57.91,40.39 53.95,40.39 R7.2
N$16
  Top 0.152: LED9-WARN.C 57.91,43.89 53.95,43.89 R9.2
N$17
  Top 0.152: LED6-IND2.C 57.91,36.88 53.95,36.88 R6.2
N$21
  Top 0.152: LED-PWR.C 57.91,47.24 53.65,47.24 R4.2
N$23
  Top 0.152: R10.1 17.53,12.04 17.53,13.87 19.51,15.85 19.51,16.76 T4.B
RST  (via drill 0.3)
  Top 0.152: 53.65,16.46 54.86,16.46 R15.1 | 53.65,16.46 51.21,18.9 51.21,19.81 51.05,19.96 R14.1 50.9,20.12 50.9,21.03 44.2,27.74 v23.77,27.74 | 53.65,16.46 50.9,13.72 50.9,12.04 C3.1
  Bottom 0.152: v23.77,27.74 10.21,41.3 4.88,41.3 RUN.2

### Text on the board
tPlace: + | + | + | + | + | + | + | +
tNames: HA Hub v3.0 / July 10, 2015 | |x> | QbitDevices.wordpress.com | Qbit Devices | FUNC | WiFi WPS | RESET
bNames: Home Automation Hub v3.0 | Qbit Devices | QbitDevices.wordpress.com
Document: TODO / 1. Add schmitt buffers for all the push buttons / 2. check the polarity of the IR LEDs / 3. Check both ICs wrt 74HC/74LV/... for 3.3V / / / DONE / 1. ELIMINATED - Verify the Watchdog circuit / 2. ELIMINATED - Will RPi gpio go in a state to allow disabling WD? / 3. Ensure long push for RESET push button (cap and resistor values) / 4. Move Power LED to the Status LEDs area / 5. check RUN location / 6. Verify the IR-RCV circuit works